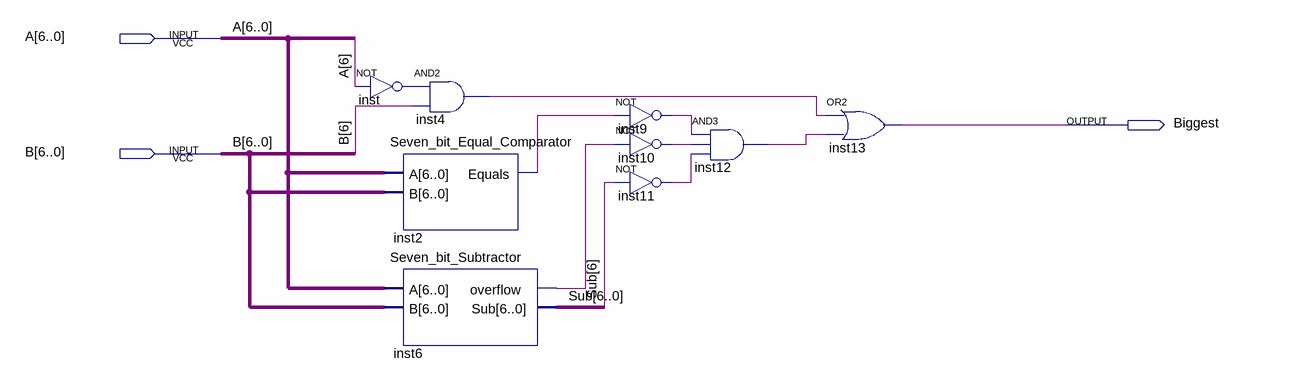
[diagram p0: schematic sheet]
// Quartus schematic Seven_bit_Biggest_Comparator.bdf as structural Verilog: 9 symbols, 3 pins
module Seven_bit_Biggest_Comparator (
  input  [6:0] A,
  input  [6:0] B,
  output Biggest
);

  wire inst2_equals, inst4_out, inst6_overflow, inst9_out, inst10_out, inst11_out, inst12_out, inst_out;
  wire [6:0] Sub;

  not inst (inst_out, A[6]);
  Seven_bit_Equal_Comparator inst2 (.A(A), .B(B), .Equals(inst2_equals));
  Seven_bit_Subtractor inst6 (.A(A), .B(B), .overflow(inst6_overflow), .Sub(Sub));
  and inst4 (inst4_out, inst_out, B[6]);
  not inst9 (inst9_out, inst2_equals);
  not inst10 (inst10_out, inst6_overflow);
  not inst11 (inst11_out, Sub[6]);
  and inst12 (inst12_out, inst9_out, inst10_out, inst11_out);
  or inst13 (Biggest, inst4_out, inst12_out);
endmodule
